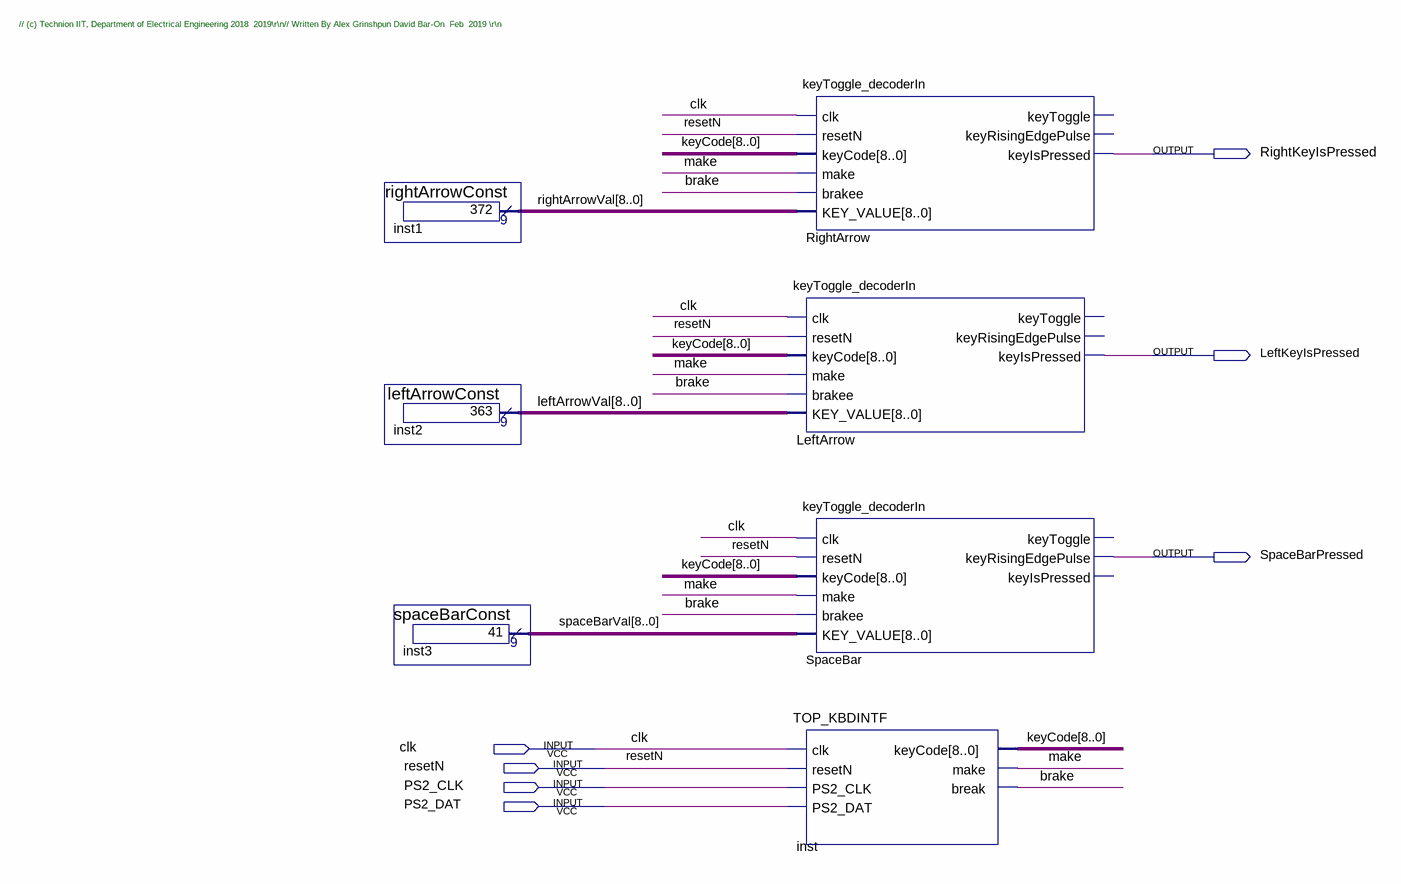
[diagram p0: schematic sheet]
// Quartus schematic TOP_KBD_DEMOALL.bdf as structural Verilog: 7 symbols, 7 pins
module TOP_KBD_DEMOALL (
  input  clk,
  input  resetN,
  input  PS2_CLK,
  input  PS2_DAT,
  output RightKeyIsPressed,
  output LeftKeyIsPressed,
  output SpaceBarPressed
);

  wire brake, make;
  wire [8:0] keyCode, leftArrowVal, rightArrowVal, spaceBarVal;

  rightArrowConst inst1 (.result(rightArrowVal));
  leftArrowConst inst2 (.result(leftArrowVal));
  spaceBarConst inst3 (.result(spaceBarVal));
  keyToggle_decoderIn RightArrow (
    .clk(clk), .resetN(resetN), .keyCode(keyCode), .make(make), .brakee(brake), .KEY_VALUE(rightArrowVal),
    .keyIsPressed(RightKeyIsPressed));  // open: keyToggle, keyRisingEdgePulse
  keyToggle_decoderIn LeftArrow (
    .clk(clk), .resetN(resetN), .keyCode(keyCode), .make(make), .brakee(brake), .KEY_VALUE(leftArrowVal),
    .keyIsPressed(LeftKeyIsPressed));  // open: keyToggle, keyRisingEdgePulse
  keyToggle_decoderIn SpaceBar (
    .clk(clk), .resetN(resetN), .keyCode(keyCode), .make(make), .brakee(brake), .KEY_VALUE(spaceBarVal),
    .keyRisingEdgePulse(SpaceBarPressed));  // open: keyToggle, keyIsPressed
  TOP_KBDINTF inst (
    .clk(clk), .resetN(resetN), .PS2_CLK(PS2_CLK), .PS2_DAT(PS2_DAT), .keyCode(keyCode), .make(make),
    .\break (brake));

  // Notes on the sheet:
  //   // (c) Technion IIT, Department of Electrical Engineering 2018  2019\r\n// Written By Alex Grinshpun David Bar-On  Feb  2019 \r\n
endmodule
